# Altium schematic sheet 9.RK3588_USB_Controler.SchDoc
size A3; SheetNumber: 9; SheetTotal: 21
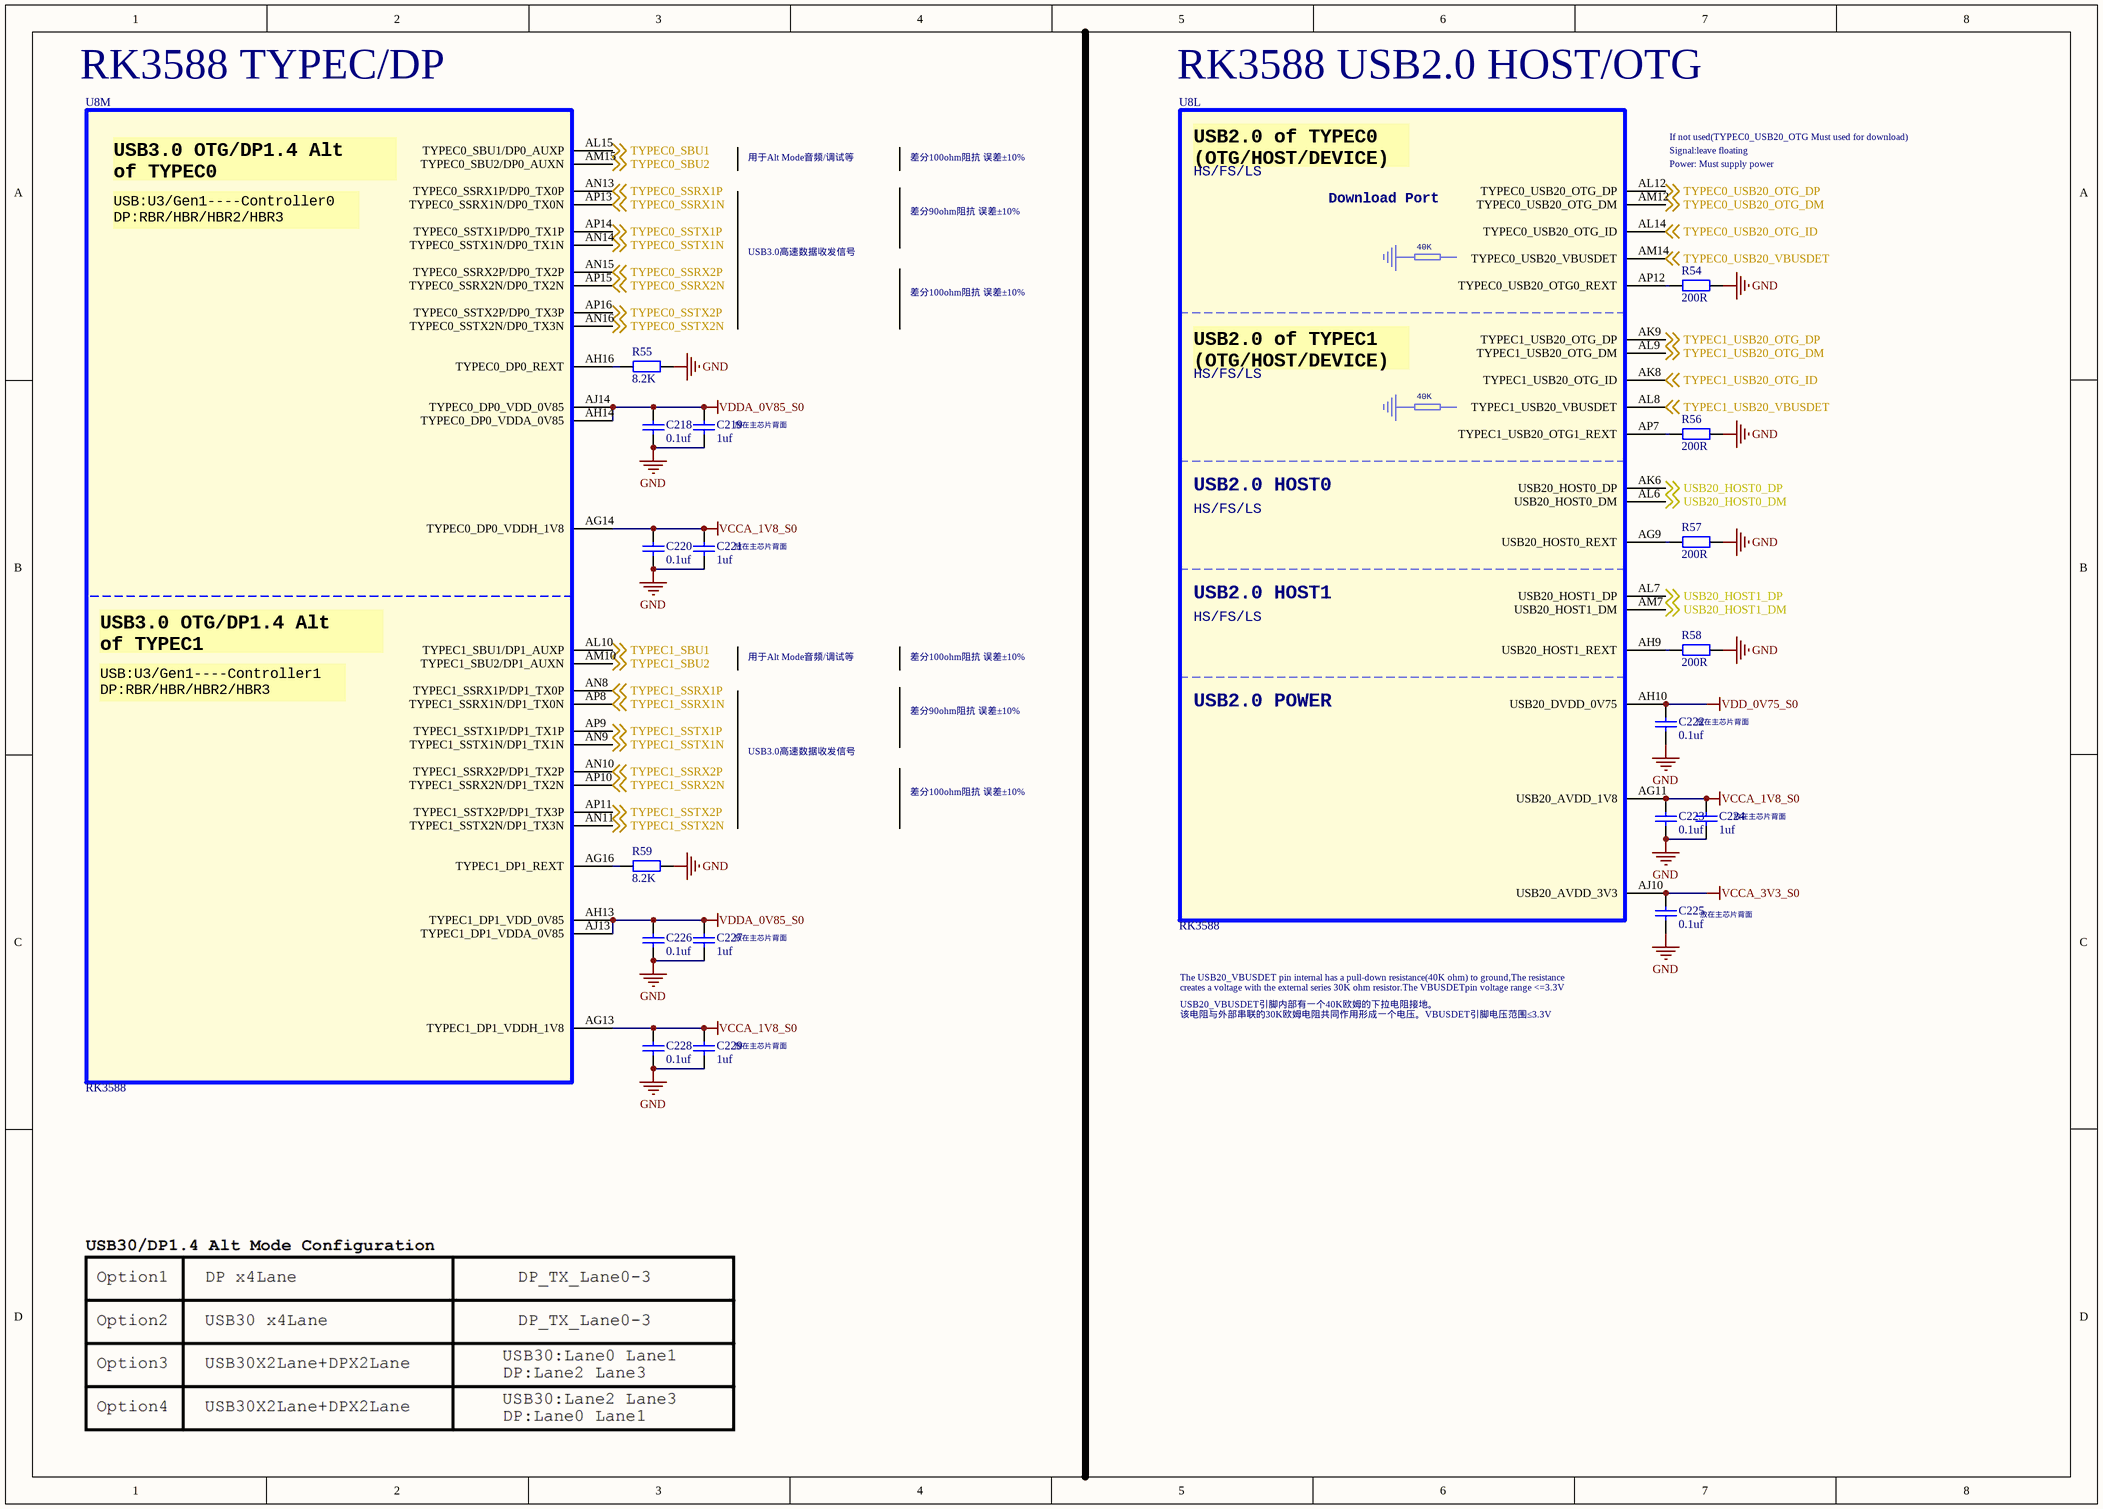
[diagram p0: 9.RK3588_USB_Controler.SchDoc]

## Parts
C218  0.1uf  [C0201_L]
C219  1uf  [C0201_L]
C220  0.1uf  [C0201_L]
C221  1uf  [C0201_L]
C222  0.1uf  [C0201_L]
C223  0.1uf  [C0201_L]
C224  1uf  [C0201_L]
C225  0.1uf  [C0201_L]
C226  0.1uf  [C0201_L]
C227  1uf  [C0201_L]
C228  0.1uf  [C0201_L]
C229  1uf  [C0201_L]
R54  200R  [R0201_L]
R55  8.2K  [R0201_L]
R56  200R  [R0201_L]
R57  200R  [R0201_L]
R58  200R  [R0201_L]
R59  8.2K  [R0201_L]
U8  RK3588  [BGA1088_23R00X23R00X2R00]  (parts L,M of 26)

## Nets
GND: C218.1 C219.1 C220.1 C221.1 C222.1 C223.1 C224.1 C225.1 C226.1 C227.1 C228.1 C229.1 R54.2 R55.2 R56.2 R57.2 R58.2 R59.2
VCCA_1V8_S0: C220.2 C221.2 C223.2 C224.2 C228.2 C229.2 U8.AG11(USB20_AVDD_1V8) U8.AG13(TYPEC1_DP1_VDDH_1V8) U8.AG14(TYPEC0_DP0_VDDH_1V8)
VCCA_3V3_S0: C225.2 U8.AJ10(USB20_AVDD_3V3)
VDD_0V75_S0: C222.2 U8.AH10(USB20_DVDD_0V75)
VDDA_0V85_S0: C218.2 C219.2 C226.2 C227.2 U8.AH13(TYPEC1_DP1_VDD_0V85) U8.AH14(TYPEC0_DP0_VDDA_0V85) U8.AJ13(TYPEC1_DP1_VDDA_0V85) U8.AJ14(TYPEC0_DP0_VDD_0V85)
TYPEC0_SBU1: U8.AL15(TYPEC0_SBU1/DP0_AUXP) ; off-sheet TYPEC0_SBU1
TYPEC0_SBU2: U8.AM15(TYPEC0_SBU2/DP0_AUXN) ; off-sheet TYPEC0_SBU2
TYPEC0_SSRX1N: U8.AP13(TYPEC0_SSRX1N/DP0_TX0N) ; off-sheet TYPEC0_SSRX1N
TYPEC0_SSRX1P: U8.AN13(TYPEC0_SSRX1P/DP0_TX0P) ; off-sheet TYPEC0_SSRX1P
TYPEC0_SSRX2N: U8.AP15(TYPEC0_SSRX2N/DP0_TX2N) ; off-sheet TYPEC0_SSRX2N
TYPEC0_SSRX2P: U8.AN15(TYPEC0_SSRX2P/DP0_TX2P) ; off-sheet TYPEC0_SSRX2P
TYPEC0_SSTX1N: U8.AN14(TYPEC0_SSTX1N/DP0_TX1N) ; off-sheet TYPEC0_SSTX1N
TYPEC0_SSTX1P: U8.AP14(TYPEC0_SSTX1P/DP0_TX1P) ; off-sheet TYPEC0_SSTX1P
TYPEC0_SSTX2N: U8.AN16(TYPEC0_SSTX2N/DP0_TX3N) ; off-sheet TYPEC0_SSTX2N
TYPEC0_SSTX2P: U8.AP16(TYPEC0_SSTX2P/DP0_TX3P) ; off-sheet TYPEC0_SSTX2P
TYPEC0_USB20_OTG_DM: U8.AM12(TYPEC0_USB20_OTG_DM) ; off-sheet TYPEC0_USB20_OTG_DM
TYPEC0_USB20_OTG_DP: U8.AL12(TYPEC0_USB20_OTG_DP) ; off-sheet TYPEC0_USB20_OTG_DP
TYPEC0_USB20_OTG_ID: U8.AL14(TYPEC0_USB20_OTG_ID) ; off-sheet TYPEC0_USB20_OTG_ID
TYPEC0_USB20_VBUSDET: U8.AM14(TYPEC0_USB20_VBUSDET) ; off-sheet TYPEC0_USB20_VBUSDET
TYPEC1_SBU1: U8.AL10(TYPEC1_SBU1/DP1_AUXP) ; off-sheet TYPEC1_SBU1
TYPEC1_SBU2: U8.AM10(TYPEC1_SBU2/DP1_AUXN) ; off-sheet TYPEC1_SBU2
TYPEC1_SSRX1N: U8.AP8(TYPEC1_SSRX1N/DP1_TX0N) ; off-sheet TYPEC1_SSRX1N
TYPEC1_SSRX1P: U8.AN8(TYPEC1_SSRX1P/DP1_TX0P) ; off-sheet TYPEC1_SSRX1P
TYPEC1_SSRX2N: U8.AP10(TYPEC1_SSRX2N/DP1_TX2N) ; off-sheet TYPEC1_SSRX2N
TYPEC1_SSRX2P: U8.AN10(TYPEC1_SSRX2P/DP1_TX2P) ; off-sheet TYPEC1_SSRX2P
TYPEC1_SSTX1N: U8.AN9(TYPEC1_SSTX1N/DP1_TX1N) ; off-sheet TYPEC1_SSTX1N
TYPEC1_SSTX1P: U8.AP9(TYPEC1_SSTX1P/DP1_TX1P) ; off-sheet TYPEC1_SSTX1P
TYPEC1_SSTX2N: U8.AN11(TYPEC1_SSTX2N/DP1_TX3N) ; off-sheet TYPEC1_SSTX2N
TYPEC1_SSTX2P: U8.AP11(TYPEC1_SSTX2P/DP1_TX3P) ; off-sheet TYPEC1_SSTX2P
TYPEC1_USB20_OTG_DM: U8.AL9(TYPEC1_USB20_OTG_DM) ; off-sheet TYPEC1_USB20_OTG_DM
TYPEC1_USB20_OTG_DP: U8.AK9(TYPEC1_USB20_OTG_DP) ; off-sheet TYPEC1_USB20_OTG_DP
TYPEC1_USB20_OTG_ID: U8.AK8(TYPEC1_USB20_OTG_ID) ; off-sheet TYPEC1_USB20_OTG_ID
TYPEC1_USB20_VBUSDET: U8.AL8(TYPEC1_USB20_VBUSDET) ; off-sheet TYPEC1_USB20_VBUSDET
USB20_HOST0_DM: U8.AL6(USB20_HOST0_DM) ; off-sheet USB20_HOST0_DM
USB20_HOST0_DP: U8.AK6(USB20_HOST0_DP) ; off-sheet USB20_HOST0_DP
USB20_HOST1_DM: U8.AM7(USB20_HOST1_DM) ; off-sheet USB20_HOST1_DM
USB20_HOST1_DP: U8.AL7(USB20_HOST1_DP) ; off-sheet USB20_HOST1_DP
NetR54_1: R54.1 U8.AP12(TYPEC0_USB20_OTG0_REXT)
NetR55_1: R55.1 U8.AH16(TYPEC0_DP0_REXT)
NetR56_1: R56.1 U8.AP7(TYPEC1_USB20_OTG1_REXT)
NetR57_1: R57.1 U8.AG9(USB20_HOST0_REXT)
NetR58_1: R58.1 U8.AH9(USB20_HOST1_REXT)
NetR59_1: R59.1 U8.AG16(TYPEC1_DP1_REXT)

## Notes on the sheet
- RK3588 TYPEC/DP
- RK3588 USB2.0 HOST/OTG
- 用于Alt Mode音频/调试等
- 差分100ohm阻抗 误差±10%
- If not used(TYPEC0_USB20_OTG Must used for download)
- Signal:leave floating
- (near U8) Power: Must supply power
- 差分90ohm阻抗 误差±10%
- USB3.0高速数据收发信号
- (near C219) 放在主芯片背面
- (near C221) 放在主芯片背面
- (near C222) 放在主芯片背面
- (near C224) 放在主芯片背面
- (near C225) 放在主芯片背面
- (near C227) 放在主芯片背面
- The USB20_VBUSDET pin internal has a pull-down resistance(40K ohm) to ground,The resistance
- creates a voltage with the external series 30K ohm resistor.The VBUSDETpin voltage range <=3.3V
- (near C229) 放在主芯片背面
- USB20_VBUSDET引脚内部有一个40K欧姆的下拉电阻接地。
- 该电阻与外部串联的30K欧姆电阻共同作用形成一个电压。VBUSDET引脚电压范围≤3.3V
- (in symbol SOC_RK3588, part L) USB2.0 of TYPEC0 / (OTG/HOST/DEVICE); HS/FS/LS; Download Port; 40K; USB2.0 of TYPEC1 / (OTG/HOST/DEVICE); USB2.0 HOST0; USB2.0 HOST1; USB2.0 POWER
- (in symbol SOC_RK3588, part M) USB3.0 OTG/DP1.4 Alt / of TYPEC0; USB:U3/Gen1----Controller0 / DP:RBR/HBR/HBR2/HBR3; USB3.0 OTG/DP1.4 Alt / of TYPEC1; USB:U3/Gen1----Controller1 / DP:RBR/HBR/HBR2/HBR3

## Library data of the parts
C218-C229 = C: 贴片电容/MLCC电容
R54-R59 = R: 贴片电阻
U8 = SOC_RK3588: ROCKCHIP SOC